# EAGLE design S6 BUCK CONVERTER - PCB (EAGLE 9.6.2)
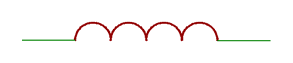
[diagram p0: schematic, sheet 1, part 1 of 3]
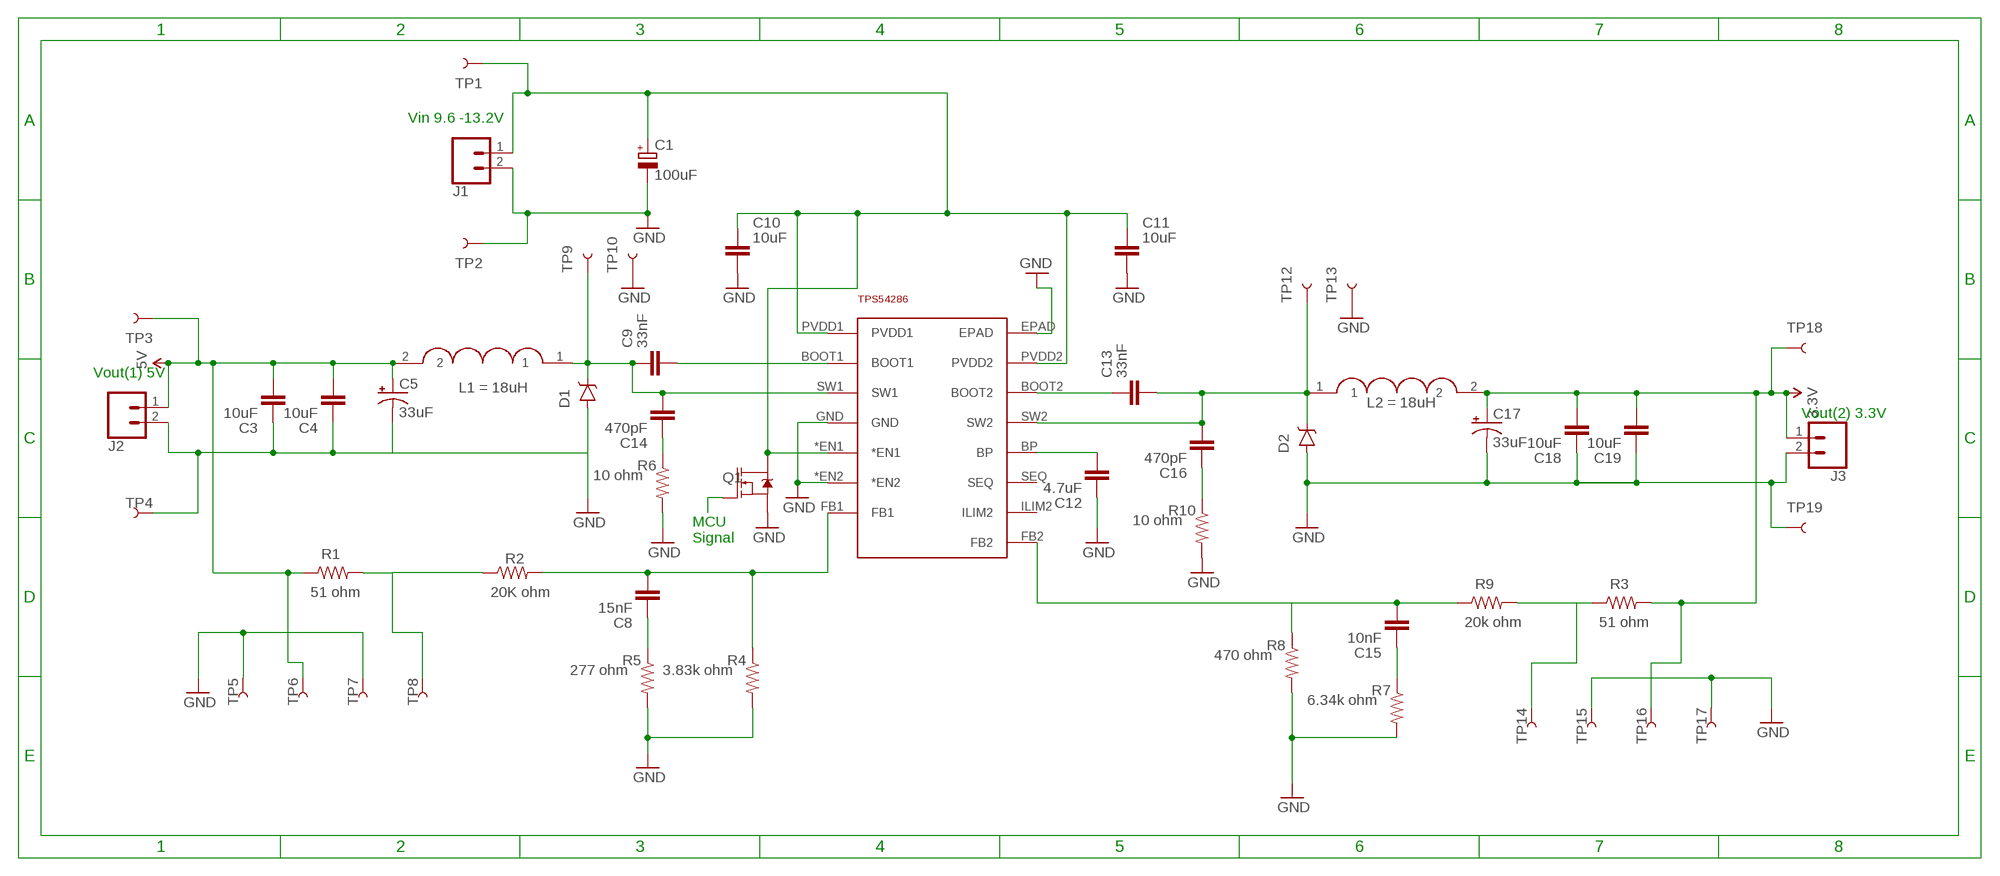
[diagram p1: schematic, sheet 1, part 2 of 3]
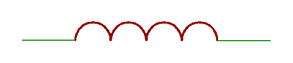
[diagram p2: schematic, sheet 1, part 3 of 3]

## Parts
C1  100uF  C-POL_ECAP-8.5MM  [CAPAE830X1050N]
C3  10uF  C_CHIP-0603(1608-METRIC)  [CAPC1608X85]
C4  10uF  C_CHIP-0603(1608-METRIC)  [CAPC1608X85]
C5  33uF  C-POL-US_RADIAL-20MM-DIA  [CAPPRD550W60D1200H2000B]
C8  15nF  C_CHIP-0603(1608-METRIC)  [CAPC1608X85]
C9  33nF  C_CHIP-0603(1608-METRIC)  [CAPC1608X85]
C10  10uF  C_CHIP-1206(3216-METRIC)  [CAPC3216X135]
C11  10uF  C_CHIP-1206(3216-METRIC)  [CAPC3216X135]
C12  4.7uF  C_CHIP-0603(1608-METRIC)  [CAPC1608X85]
C13  33nF  C_CHIP-0603(1608-METRIC)  [CAPC1608X85]
C14  470pF  C_CHIP-0603(1608-METRIC)  [CAPC1608X85]
C15  10nF  C_CHIP-0603(1608-METRIC)  [CAPC1608X85]
C16  470pF  C_CHIP-0603(1608-METRIC)  [CAPC1608X85]
C17  33uF  C-POL-US_RADIAL-20MM-DIA  [CAPPRD550W60D1200H2000B]
C18  10uF  C_CHIP-0603(1608-METRIC)  [CAPC1608X85]
C19  10uF  C_CHIP-0603(1608-METRIC)  [CAPC1608X85]
D1  MBRA140  [SMA-DIODE]
D2  MBRA140  [SMA-DIODE]
J1  CONN_02  [1X02]
J2  CONN_02  [1X02]
J3  CONN_02  [1X02]
L1  INDUCTOR-18UH  [INDUCTOR-18UH]
L2  INDUCTOR-18UH  [INDUCTOR-18UH]
Q1  310mA/60V/1.6Ω  MOSFET-NCH-2N7002PW  [SOT323]
R1  51 ohm  RESISTOR0603-RES  [0603-RES]
R2  20K ohm  RESISTOR0603-RES  [0603-RES]
R3  51 ohm  RESISTOR0603-RES  [0603-RES]
R4  3.83k ohm  RESISTOR0603-RES  [0603-RES]
R5  277 ohm  RESISTOR0603-RES  [0603-RES]
R6  10 ohm  RESISTOR0603-RES  [0603-RES]
R7  6.34k ohm  RESISTOR0603-RES  [0603-RES]
R8  470 ohm  RESISTOR0603-RES  [0603-RES]
R9  20k ohm  RESISTOR0603-RES  [0603-RES]
R10  10 ohm  RESISTOR0603-RES  [0603-RES]
TP1  TEST-POINT3X5  [PAD.03X.05]
TP2  TEST-POINT3X5  [PAD.03X.05]
TP3  TEST-POINT3X5  [PAD.03X.05]
TP4  TEST-POINT3X5  [PAD.03X.05]
TP5  TEST-POINT3X5  [PAD.03X.05]
TP6  TEST-POINT3X5  [PAD.03X.05]
TP7  TEST-POINT3X5  [PAD.03X.05]
TP8  TEST-POINT3X5  [PAD.03X.05]
TP9  TEST-POINT3X5  [PAD.03X.05]
TP10  TEST-POINT3X5  [PAD.03X.05]
TP12  TEST-POINT3X5  [PAD.03X.05]
TP13  TEST-POINT3X5  [PAD.03X.05]
TP14  TEST-POINT3X5  [PAD.03X.05]
TP15  TEST-POINT3X5  [PAD.03X.05]
TP16  TEST-POINT3X5  [PAD.03X.05]
TP17  TEST-POINT3X5  [PAD.03X.05]
TP18  TEST-POINT3X5  [PAD.03X.05]
TP19  TEST-POINT3X5  [PAD.03X.05]
U$1  TPS54286  [PWP14_2P31X2P46-L]

## Nets
3.3V: C17.1(+) C18.2 C19.2 J3.1 L2.2 R3.2 TP16.P$1 TP18.P$1
5V: C3.2 C4.2 C5.1(+) J2.1 L1.2 R1.1 TP3.P$1 TP6.P$1
GND [ground]: C1.2(-) C3.1 C4.1 C5.2(-) C10.2 C11.2 C12.1 C17.2(-) C18.1 C19.1 D1.A D2.A J1.2 J2.2 J3.2 Q1.2(S) R4.2 R5.2 R6.2 R7.2 R8.2 R10.2 TP2.P$1 TP4.P$1 TP5.P$1 TP7.P$1 TP10.P$1 TP13.P$1 TP15.P$1 TP17.P$1 TP19.P$1 U$1.*EN2 U$1.EPAD U$1.GND
N$1: C9.2 U$1.BOOT1
N$2: C13.1 U$1.BOOT2
N$4: C14.1 R6.1
N$6: C13.2 C16.2 D2.C L2.1 TP12.P$1 U$1.SW2
N$7: C16.1 R10.1
N$8: C9.1 C14.2 D1.C L1.1 TP9.P$1 U$1.SW1
N$9: C12.2 U$1.BP
N$13: C8.2 R2.2 R4.1 U$1.FB1
N$15: C8.1 R5.1
N$16: C15.1 R7.1
N$18: Q1.1(G)
N$19: C1.1(+) C10.1 C11.1 J1.1 Q1.3(D) TP1.P$1 U$1.*EN1 U$1.PVDD1 U$1.PVDD2
N$20: C15.2 R8.1 R9.1 U$1.FB2
N$21: R3.1 R9.2 TP14.P$1
N$22: R1.2 R2.1 TP8.P$1
Unconnected: U$1.ILIM2 U$1.SEQ

## Notes on the sheet
- Vin 9.6 -13.2V
- Vout(1) 5V
- Vout(2) 3.3V
- MCU
  Signal

## Library data of the parts
C1 = Capacitor:C-POL: Capacitor Polarised - Generic; CATEGORY: Capacitor
C3 C4 C8-C16 C18 C19 = Capacitor:C: Capacitor - Generic; CATEGORY: Capacitor
C5 C17 = Capacitor:C-POL-US: Capacitor Polarised - ANSI; CATEGORY: Capacitor
D1 D2 = SparkFun-DiscreteSemi:MBRA140: 40V, 1A Schottky rectifier SMA/DO-214AC package DIO-08053; PROD_ID: DIO-08053
J1-J3 = SparkFun-Connectors:CONN_02: Multi connection point. Often used as Generic Header-pin footprint for 0.1 inch spaced/style header connections On any of the 0.1 inch spaced packages, you can populate with these: Break Away Headers - Straight <https://www.sparkfun.com/products/116> (PRT-00116) Break Away Male Headers - Right Angle <https://www.sparkfun.com/products/553> (PRT-00553) Female Headers <https://www.sparkfun.com/products/115> (PRT-00115) Break Away Headers - Machine Pin <https://www.sparkfun.com/products/117> (PRT-00117) Break Away Female Headers - Swiss Machine Pin <https://www.sparkfun.com/products/743> (PRT-00743) For SCREWTERMINALS and SPRING TERMINALS visit here: Screw Terimnals on SparkFun.com <https://www.sparkfun.com/search/results?term=Screw+Terminals> (5mm/3.5mm/2.54mm spacing) This device is also useful as a general connection point to wire up your design to another part of your project. Our various solder wires solder well into these plated through hole pads. Hook-Up Wire - Assortment (Stranded, 22 AWG) <https://www.sparkfun.com/products/11375> (PRT-11375) Hook-Up Wire - Assortment (Solid Core, 22 AWG) <https://www.sparkfun.com/products/11367> (PRT-11367) View the entire wire category on our website here <https://www.sparkfun.com/categories/141> Special notes: Molex polarized connector foot print use with: PRT-08233 with associated crimp pins and housings. 2.54_SCREWTERM for use with PRT-10571. 3.5mm Screw Terminal footprints for PRT-08084 5mm Screw Terminal footprints for use with PRT-08432
L1 = Inductor 18uH:INDUCTOR-18UH; L1: 18uH
L2 = Inductor 18uH:INDUCTOR-18UH; L2: 18uH
Q1 = SparkFun-DiscreteSemi:MOSFET-NCH: N-channel MOSFETs Voltage controlled devices that allow control of high current outputs. SparkFun Products: SparkFun OpenScale <https://www.sparkfun.com/products/13261> SparkFun Digital Sandbox <https://www.sparkfun.com/products/12651> SparkFun Monster Moto Shield <https://www.sparkfun.com/products/10182> SparkFun MOSFET Power Controller <https://www.sparkfun.com/products/11214>; PROD_ID: TRANS-11151
R1-R10 = SparkFun:RESISTOR: Resistor Basic schematic elements and footprints for 0603, 1206, and PTH resistors.
TP1-TP10 TP12-TP19 = SparkFun-Connectors:TEST-POINT: SparkFun Test Points Bare copper test points for troubleshooting or In-Circuit-Testing. These are used by our Production team for verifying production board runs using pogo-pins on test beds. SparkFun Products: SparkFun LSM9DS1 Breakout <https://www.sparkfun.com/products/13284> SparkFun PSOC <https://www.sparkfun.com/products/13714> SparkFun Load Cell Amplifier <https://www.sparkfun.com/products/13879>
U$1 = Buck converter TPS54286:TPS54286

## Module TPS54386
Ports: 

### Library data of the parts

## Net classes
2 ground: width 0.254 mm, drill 0.254 mm, clearance 0.152 mm

## Board
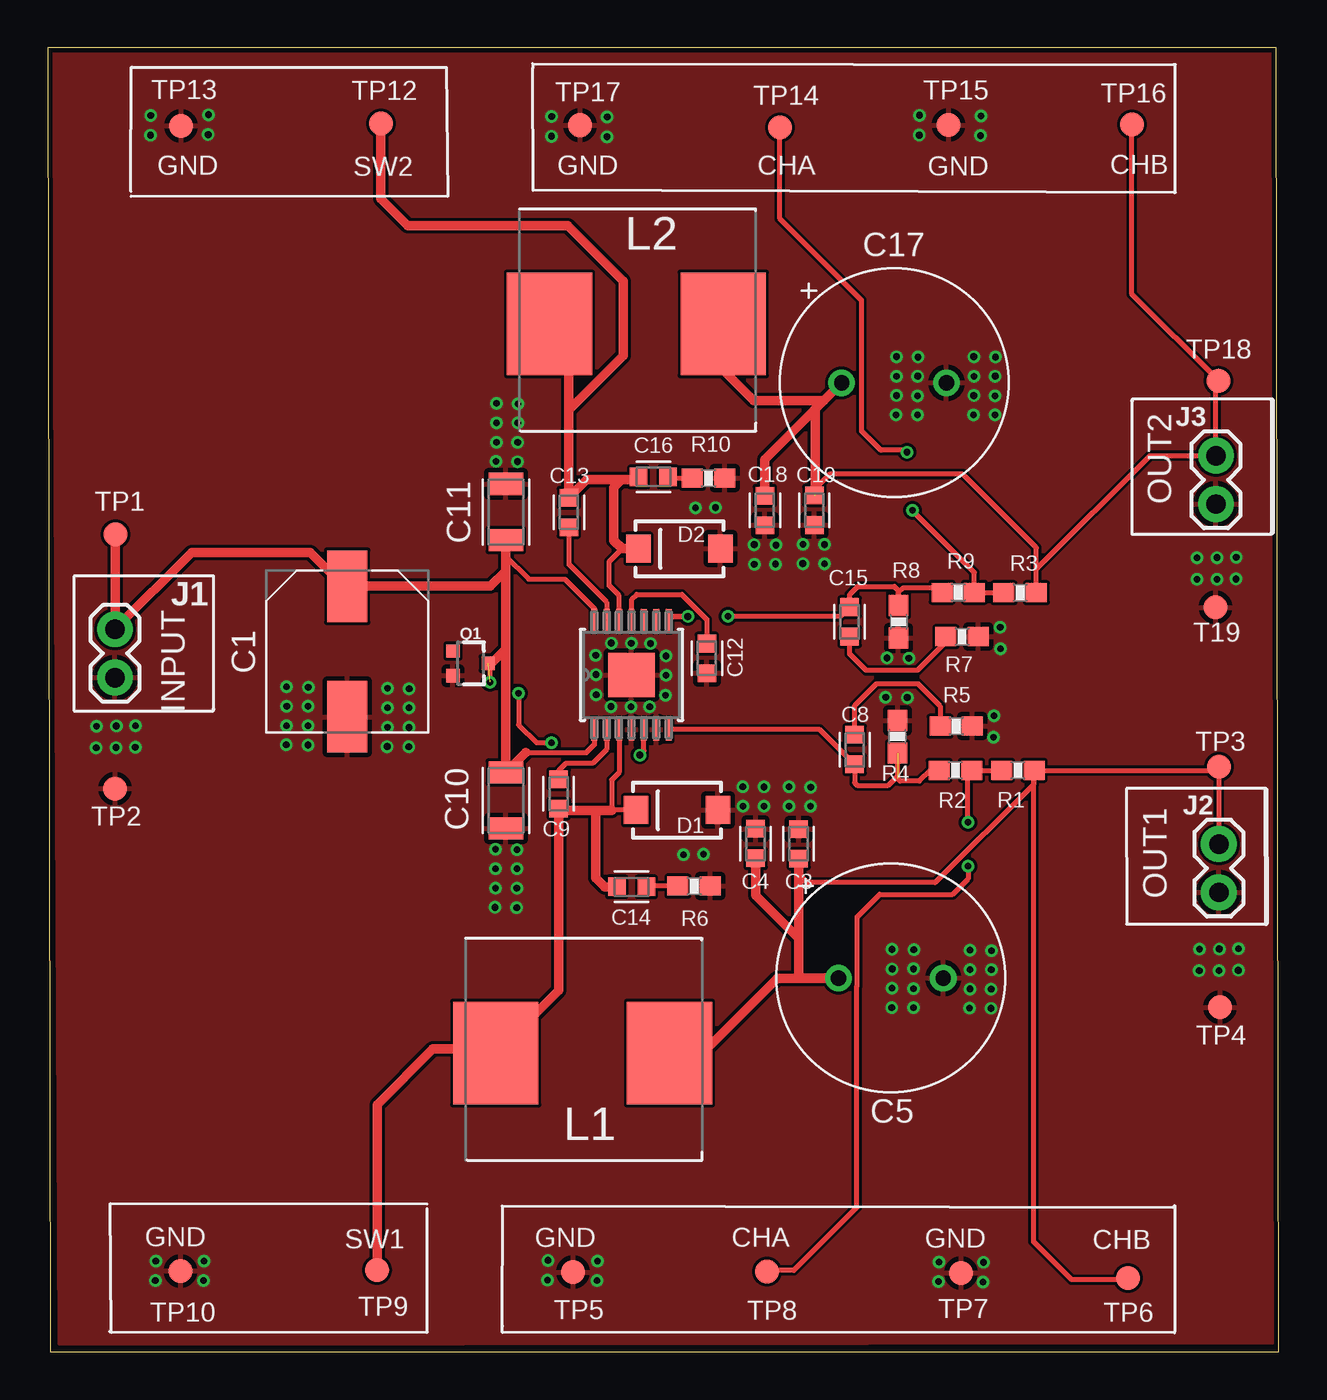
[diagram p3: board, top side]
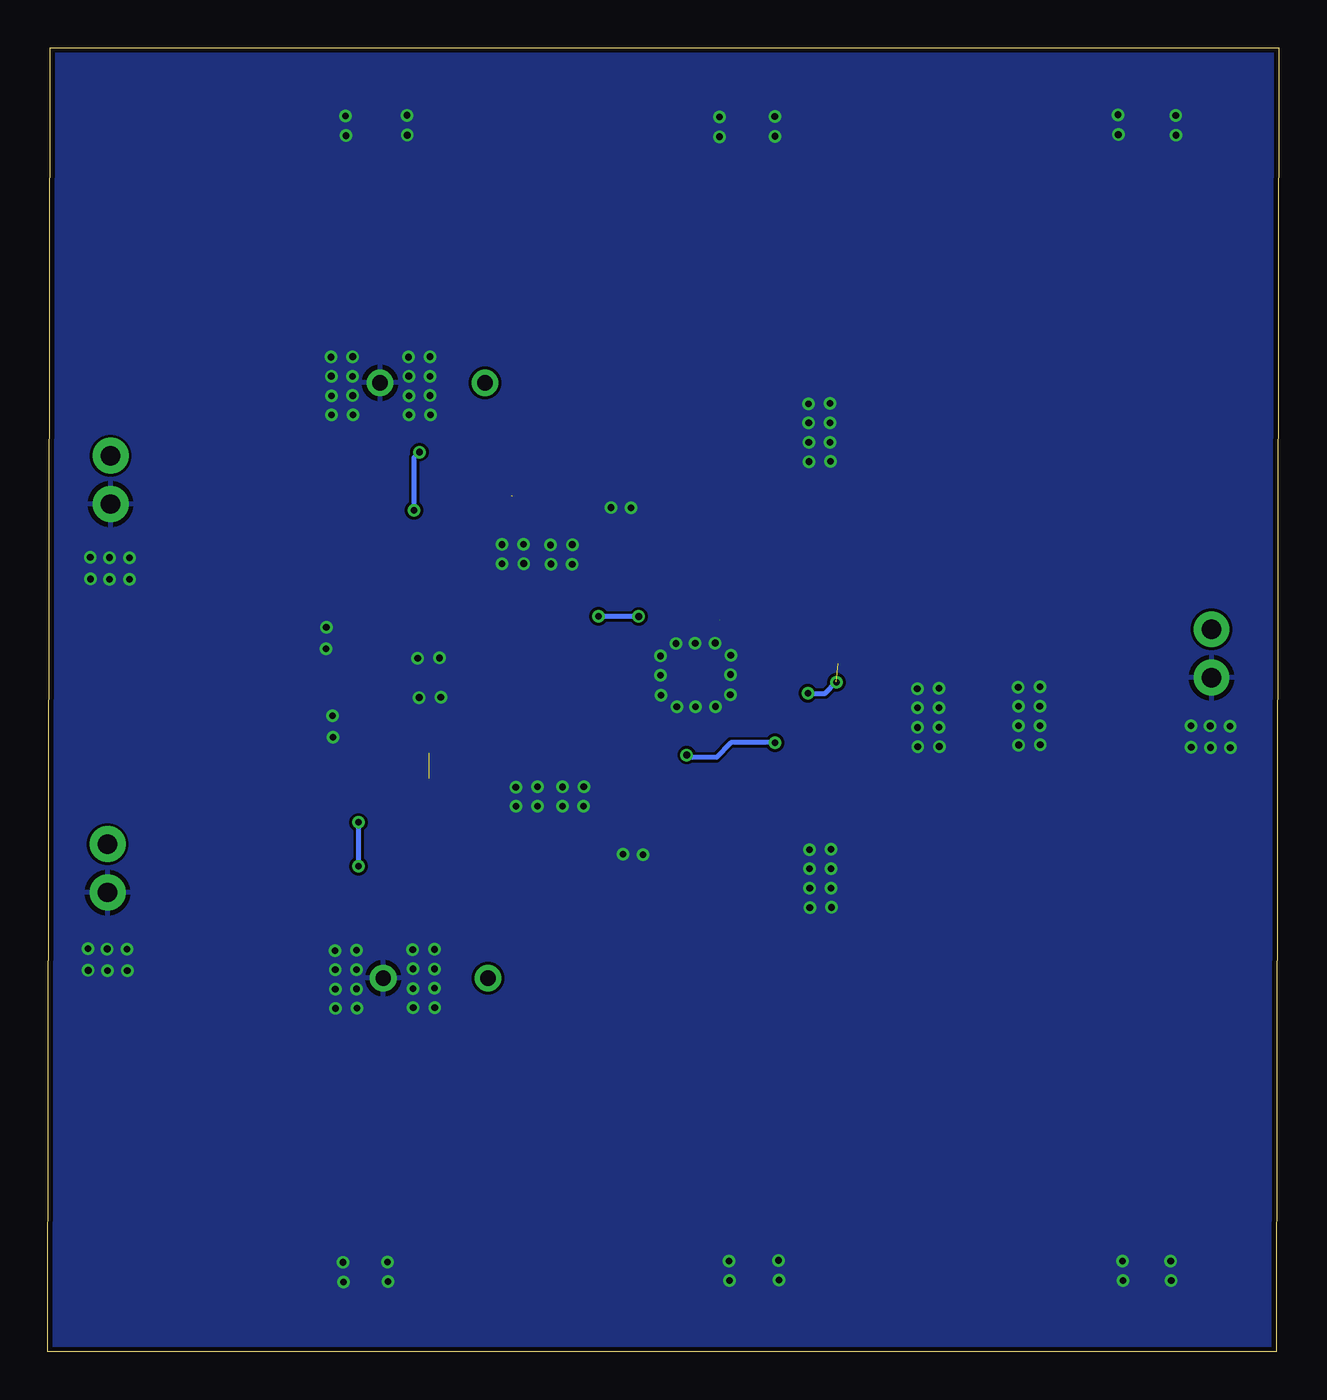
[diagram p4: board, bottom side, seen from below]

Size 64.59 x 68.44 mm. Coordinates in mm from the lower left corner, seen from the top.
Outline: 0.15,0 64.59,0 64.44,68.44 0,68.44 0.15,0
Copper layers (1*16): Top 0.035mm / dielectric 1.5mm / Bottom 0.035mm
Design rules "default *": minimum track width 6mil, minimum drill 0.35mm, track to track 6mil, track to pad 6mil, pad to pad 6mil, via to via 13.5mil, smd to smd 6mil, copper to edge 10mil, drill to drill 13mil, minimum pad ring 10mil, minimum via ring 6mil, stop-mask expansion 4mil, vias tented up to drill 0mil, thermal gap 10mil

### Footprints (pad centres in the part's own frame; a part is rotated, then mirrored left to right if it is on the bottom)
CAPAE830X1050N = smd 3.764 x 2.115: 1 -3.426,0; 2 3.426,0
CAPC1608X85 = smd 0.921 x 0.97: 1 -0.775,0; 2 0.775,0
CAPPRD550W60D1200H2000B = drill 0.8 pad 1.4: 1 -2.75,0; 2 2.75,0
CAPC3216X135 = smd 1.165 x 1.815: 1 -1.475,0; 2 1.475,0
SMA-DIODE = smd 1.27 x 1.47: A -2.15,0; C 2.15,0
1X02 = drill 1.016 pad 1.88: 1 0,0; 2 2.54,0
INDUCTOR-18UH = smd 4.47 x 5.4: 1 -21.209,7.303; 2 -12.092,7.303
SOT323 = smd 0.7 x 0.7: 1 -0.65,-0.925; 2 0.65,-0.925; 3 0,0.925
0603-RES = smd 1.1 x 1: 1 -0.85,0; 2 0.85,0
PAD.03X.05 = smd 1.27 x 1.27: P$1 0,0
PWP14_2P31X2P46-L = smd 1.168 x 0.305: *EN1 -2.87,-0.65; *EN2 -2.87,-1.3; BOOT1 -2.87,1.3; BOOT2 2.87,1.3; BP 2.87,0; FB1 -2.87,-1.95; FB2 2.87,-1.95; GND -2.87,0; ILIM2 2.87,-1.3; PVDD1 -2.87,1.95; PVDD2 2.87,1.95; SEQ 2.87,-0.65; SW1 -2.87,0.65; SW2 2.87,0.65 | smd 2.31 x 2.46: EPAD 0,0

### Placement (x,y rotation side)
C1  15.72,36.75 270 top
C3  39.39,26.66 270 top
C4  37.13,26.67 270 top
C5  44.23,19.61 0 top
C8  42.34,31.61 270 top
C9  26.81,29.28 90 top
C10  24.04,28.94 270 top
C11  24.04,44.08 90 top
C12  34.58,36.4 90 top
C13  27.34,44.05 90 top
C14  30.63,24.4 180 top
C15  42.06,38.31 90 top
C16  31.78,45.92 180 top
C17  44.4,50.85 0 top
C18  37.62,44.16 90 top
C19  40.22,44.16 90 top
D1  33.01,28.43 180 top
D2  33.15,42.15 180 top
J1  3.53,37.92 270 top
J2  61.44,26.65 270 top
J3  61.29,47.03 270 top
L1  44.72,8.37 0 top
L2  47.53,46.64 0 top
Q1  22.19,36.13 270 top
R1  50.9,30.51 180 top
R2  47.62,30.52 180 top
R3  51.02,39.85 0 top
R4  44.58,32.29 90 top
R5  47.67,32.83 0 top
R6  33.91,24.45 0 top
R7  47.97,37.53 0 top
R8  44.63,38.31 270 top
R9  47.77,39.86 0 top
R10  34.67,45.85 0 top
TP1  3.56,42.89 0 top
TP2  3.54,29.56 0 top
TP3  61.45,30.72 0 top
TP4  61.5,18.08 0 top
TP5  27.57,4.18 0 top
TP6  56.68,3.87 0 top
TP7  47.92,4.15 0 top
TP8  37.73,4.21 0 top
TP9  17.28,4.29 0 top
TP10  6.98,4.25 0 top
TP12  17.48,64.47 0 top
TP13  7,64.34 0 top
TP14  38.41,64.25 0 top
TP15  47.26,64.38 0 top
TP16  56.88,64.41 0 top
TP17  27.93,64.37 0 top
TP18  61.42,50.96 0 top
TP19  61.27,39.06 0 top
U$1  30.63,35.53 90 top

### Tracks (layer width: path | path; a pad name or v marks a point on that pad's centre or on a via)
3.3V  (1 unrouted)
  Top 0.254: 40.26,45.3 41.02,46.06 48.01,46.06 51.87,42.2 R3.2 51.87,41.07 57.83,47.03 J3.1 61.29,50.83 TP18.P$1 56.88,55.51 TP16.P$1
  Top 0.508: L2.2 35.44,51.52 37.04,49.92 40.72,49.92 C17.1 40.26,49.46 | 40.26,49.46 40.22,49.42 40.22,49.43 37.62,46.83 C18.2 | 40.26,49.46 40.26,45.3 40.26,44.94
5V
  Top 0.254: C3.2 39.39,25.07 39.84,24.62 | 39.84,24.62 | 51.72,30.35 51.72,29.78 46.56,24.62 39.84,24.62 | TP3.P$1 61.45,30.67 | 61.45,30.67 J2.1 | 61.45,30.67 61.29,30.51 R1.1 51.75,30.38 51.72,30.35 | TP6.P$1 56.59,3.78 53.72,3.78 51.71,5.79 51.71,30.35 51.72,30.35
  Top 0.508: L1.2 34.35,15.68 38.28,19.6 41.47,19.6 C5.1 39.39,19.61 39.39,21.71 | 39.39,21.71 37.13,23.96 C4.2 | C3.2 39.39,21.71
GND  (via drill 0.35)
  Top 0.254: 47.21,64.33 TP15.P$1 | C10.2 24.49,27.91 | 30.63,35.02 U$1.EPAD 30.64,35.51 | 34.72,35.48 C12.1 34.6,35.6 | D2.A 35.4,42.25 | 37.38,43.38 C18.1 | 23.54,27.46 C10.2 | 15.2,33.33 C1.2 | 23.8,27.46 C10.2
  Top 0.508: C4.1 37.04,27.35
  other vias: 12.54,34.9 12.54,33.88 12.54,32.86 12.52,31.85 13.67,34.88 13.66,33.88 13.65,32.85 13.65,31.85 17.83,34.82 17.83,33.79 17.83,32.78 17.81,31.77 18.97,34.8 18.95,33.8 18.95,32.77 18.94,31.76 23.49,26.38 23.5,25.35 23.49,24.34 23.47,23.32 24.63,26.36 24.61,25.36 24.61,24.32 24.61,23.32 23.54,49.78 23.54,48.75 23.54,47.74 23.52,46.73 24.68,49.76 24.66,48.76 24.66,47.73 24.65,46.72 38.89,29.65 38.89,28.63 36.46,29.66 36.47,28.63 40.03,29.63 40.01,28.63 37.58,29.65 37.58,28.64 37.07,42.36 37.07,41.34 39.63,42.38 39.61,41.37 38.2,42.34 38.19,41.34 40.75,42.37 40.74,41.36 29.57,37.2 30.62,37.18 31.63,37.17 29.55,33.86 30.6,33.85 31.58,33.86 28.77,34.49 28.76,35.54 28.75,36.56 32.42,34.46 32.43,35.51 32.44,36.52 44.52,52.22 44.52,51.2 44.52,50.18 44.5,49.17 45.66,52.2 45.64,51.2 45.64,50.17 45.63,49.17 48.59,52.22 48.59,51.2 48.59,50.18 48.57,49.17 49.72,52.2 49.71,51.2 49.7,50.17 49.7,49.17 45.73,64.89 45.72,63.85 48.94,63.82 26.44,64.84 26.43,63.79 29.35,64.81 29.34,63.77 5.41,64.89 5.4,63.85 8.43,64.92 8.42,63.88 48.96,64.85 44.3,21.12 44.3,20.1 44.3,19.08 44.28,18.07 45.44,21.1 45.42,20.1 45.42,19.07 45.41,18.06 48.38,21.08 48.38,20.06 48.38,19.04 48.36,18.03 49.52,21.06 49.5,20.06 49.5,19.03 49.49,18.02 5.65,3.74 5.67,4.77 8.17,3.74 8.2,4.77 26.22,3.77 26.25,4.8 28.82,3.74 28.85,4.77 46.73,3.68 46.76,4.71 49.07,3.67 49.09,4.7 61.46,21.14 60.42,21.13 62.47,21.15 61.45,20.01 60.41,20 62.46,20.02 61.35,41.68 60.3,41.67 62.35,41.69 61.34,40.55 60.29,40.54 62.34,40.56 44.04,36.42 45.17,36.4 43.96,34.36 45.1,34.34 49.98,36.89 49.97,38.02 49.62,32.25 49.64,33.39 3.6,32.84 2.56,32.83 4.61,32.85 3.59,31.71 2.55,31.7 4.6,31.72 34.4,26.11 33.36,26.1 35.03,44.31 33.98,44.29
  pour Top: 0.35,68.11 64.06,68.17 64.23,0.5 0.66,0.43
  pour Bottom: 0.2,68.28 64.31,68.25 64.48,0.21 0.33,0.14 0.18,68.29
N$1
  Top 0.254: U$1.BOOT1 29.33,31.62 28.59,30.88 27.18,30.88 26.81,30.51 C9.2
N$2  (1 unrouted)
  Top 0.254: C13.1 27.34,41.33 29.33,39.35 U$1.BOOT2
N$4
  Top 0.254: R6.1 31.45,24.45 C14.1
N$6
  Top 0.254: C16.2 30.85,45.77 | 30.09,45.8 30.12,45.77 | U$1.SW2 29.98,39.68 29.45,40.21 29.45,41.47 30.13,42.15
  Top 0.508: D2.C 30.13,42.15 29.7,42.58 29.7,45.34 30.12,45.77 | 30.12,45.77 30.85,45.77 | 30.12,45.77 28.28,45.77 C13.2 27.34,49.24 27.34,49.42 | 27.34,49.42 27.34,52.93 L2.1 | TP12.P$1 17.48,60.51 18.88,59.11 27.29,59.11 30.21,56.18 30.21,52.28 27.34,49.42
N$7
  Top 0.254: C16.1 32.63,45.85 R10.1
N$8
  Top 0.254: 29.77,24.4 C14.2 | U$1.SW1 29.98,30.41 29.58,30.02 29.58,28.43 D1.C 28.44,28.43 28.36,28.51 C9.1 29.5,28.51 29.58,28.42 | 28.76,28.42
  Top 0.508: 29.77,24.4 29.22,24.4 28.76,24.86 28.76,27.26 28.76,28.42 | 29.58,28.42 28.76,28.42 26.89,28.42 C9.1 26.81,18.97 23.73,15.9 | L1.1 23.51,16.53 | L1.1 23.73,15.9 | 23.46,15.72 L1.1 | 17.55,4.56 TP9.P$1 17.28,12.97 20.21,15.9 23.73,15.9
N$9
  Top 0.254: U$1.BP 30.65,38.42 30.65,39.5 30.89,39.75 33.27,39.75 34.58,38.44 C12.2
N$13  (1 unrouted)
  Top 0.254: R4.1 44.58,30.22 44.08,29.73 42.47,29.73 42.34,29.86 C8.2 40.51,32.66 U$1.FB1 | 44.58,30.09 44.72,29.95 45.73,29.95 46.29,30.52 R2.2
N$15
  Top 0.254: C8.1 42.34,33.91 43.5,35.07 45.63,35.07 46.82,33.89 R5.1
N$16
  Top 0.254: R7.1 47.12,37.25 45.63,35.76 42.94,35.76 42.06,36.63 C15.1
N$19  (via drill 0.35)  (1 unrouted)
  Top 0.254: U$1.PVDD1 28.68,31.86 28.26,31.45 25.07,31.45 | 24.04,41.74 25.23,40.55 27.13,40.55 28.3,39.38 28.68,39 U$1.PVDD2 | v24.71,34.56 24.71,32.91 25.65,31.97 v26.43,31.97 | v23.21,35.15 23.21,35.97 23.17,36.01 | v31.06,31.32 v31.06,31.33 31.28,31.54 U$1.*EN1
  Top 0.508: TP1.P$1 3.56,37.92 J1.1 7.56,41.95 13.77,41.95 15.54,40.18 C1.1 23.23,40.18 24.04,40.99 | 24.04,40.99 C11.1 24.04,41.74 | 24.04,40.99 24.04,36.88 | 23.17,36.01 24.04,36.88 | 24.04,36.88 C10.1 25.07,31.45
  Bottom 0.254: v24.71,34.56 23.79,34.56 v23.21,35.15 | v26.43,31.97 28.74,31.97 29.51,31.2 31.06,31.2 v31.06,31.32
N$20  (via drill 0.35)
  Top 0.254: 32.78,38.59 v33.58,38.59 32.77,38.59 U$1.FB2 | v35.69,38.59 41.57,38.59 C15.2 42.06,39.73 42.5,40.17 44.42,40.17 44.63,39.96 R8.1 44.63,39.84 44.89,40.09 46.68,40.09 R9.1
  Bottom 0.254: v33.58,38.59 v35.68,38.59 v35.69,38.59
N$21  (via drill 0.35)
  Top 0.254: R3.1 50.15,39.86 R9.2 48.62,40.91 v45.37,44.16 | v45.08,47.22 44.98,47.32 43.71,47.32 42.69,48.34 42.69,55.2 38.41,59.48 TP14.P$1
  Bottom 0.254: v45.37,44.16 45.37,46.93 v45.08,47.22
N$22  (via drill 0.35)
  Top 0.254: R1.2 R2.1 48.28,30.33 v48.28,27.79 | TP8.P$1 37.79,4.27 39.15,4.27 42.45,7.57 42.45,19.19 42.46,19.21 42.46,22.83 43.65,24.01 47.47,24.01 48.28,24.82 v48.28,25.48
  Bottom 0.254: v48.28,25.48 v48.28,27.79 | v48.28,27.79

### Text on the board
tPlace: GND | SW1
tNames: GND | GND | CHA | CHB | SW2 | GND | OUT2 | INPUT | OUT1 | GND | CHA | GND | CHB